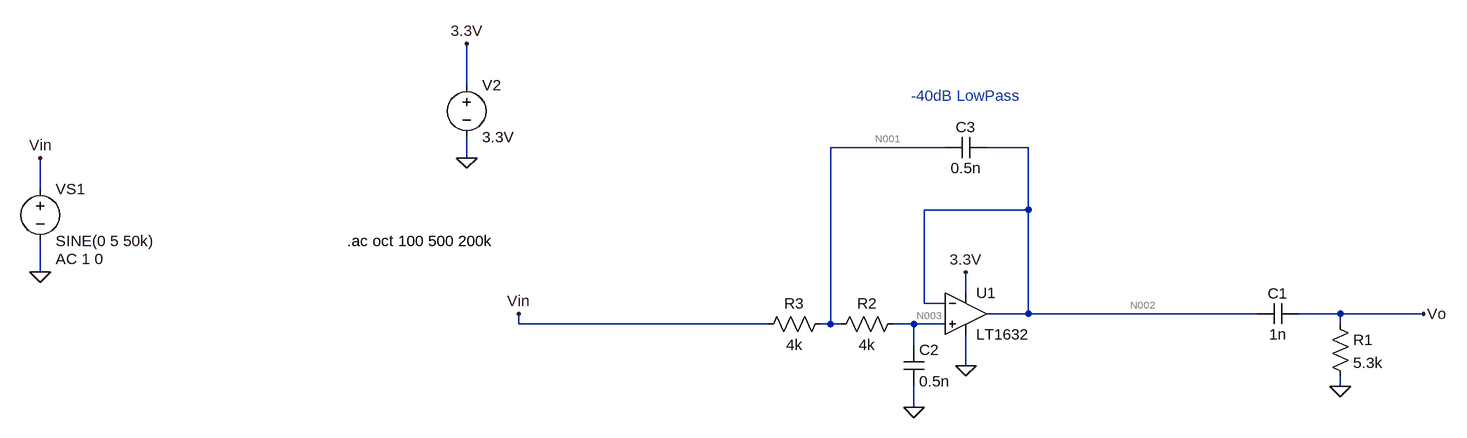
[diagram p0: schematic BandPass.asc]
BandPass.asc, the LTspice schematic file:
Version 4
SHEET 1 1588 680
WIRE 64 32 64 -32
WIRE 800 128 624 128
WIRE 928 128 864 128
WIRE 64 144 64 112
WIRE -592 192 -592 144
WIRE 928 224 928 128
WIRE 928 224 768 224
WIRE -592 320 -592 272
WIRE 832 352 832 320
WIRE 768 368 768 224
WIRE 800 368 768 368
WIRE 928 384 928 224
WIRE 928 384 864 384
WIRE 1280 384 928 384
WIRE 1408 384 1344 384
WIRE 1536 384 1408 384
WIRE 144 400 144 384
WIRE 528 400 144 400
WIRE 624 400 624 128
WIRE 624 400 608 400
WIRE 640 400 624 400
WIRE 752 400 720 400
WIRE 800 400 752 400
WIRE 1408 400 1408 384
WIRE 752 432 752 400
WIRE 832 464 832 416
WIRE 1408 496 1408 480
WIRE 752 528 752 496
FLAG 144 384 Vin
FLAG 1408 496 0
FLAG 1536 384 Vo
FLAG 64 144 0
FLAG 64 -32 3.3V
FLAG -592 320 0
FLAG -592 144 Vin
FLAG 832 320 3.3V
FLAG 752 528 0
FLAG 832 464 0
SYMBOL res 1392 384 R0
SYMATTR InstName R1
SYMATTR Value 5.3k
SYMBOL cap 1280 400 R270
WINDOW 0 32 32 VTop 2
WINDOW 3 0 32 VBottom 2
SYMATTR InstName C1
SYMATTR Value 1n
SYMBOL voltage 64 16 R0
WINDOW 123 0 0 Left 2
WINDOW 39 0 0 Left 2
SYMATTR InstName V2
SYMATTR Value 3.3V
SYMBOL voltage -592 176 R0
WINDOW 123 24 124 Left 2
WINDOW 39 0 0 Left 2
SYMATTR Value2 AC 1 0
SYMATTR InstName VS1
SYMATTR Value SINE(0 5 50k)
SYMBOL res 736 384 R90
WINDOW 0 0 56 VBottom 2
WINDOW 3 32 56 VTop 2
SYMATTR InstName R2
SYMATTR Value 4k
SYMBOL cap 736 432 R0
SYMATTR InstName C2
SYMATTR Value 0.5n
SYMBOL cap 864 112 R90
WINDOW 0 0 32 VBottom 2
WINDOW 3 32 32 VTop 2
SYMATTR InstName C3
SYMATTR Value 0.5n
SYMBOL res 624 384 R90
WINDOW 0 0 56 VBottom 2
WINDOW 3 32 56 VTop 2
SYMATTR InstName R3
SYMATTR Value 4k
SYMBOL Opamps\\LT1632 832 320 R0
SYMATTR InstName U1
TEXT -120 272 Left 2 !.ac oct 100 500 200k
TEXT 832 48 Center 2 ;-40dB LowPass

The netlist it stands for:
* BandPass.asc
R1 Vo 0 5.3k
C1 N002 Vo 1n
V2 3.3V 0 3.3V
VS1 Vin 0 SINE(0 5 50k) AC 1 0
R2 N003 N001 4k
C2 N003 0 0.5n
C3 N002 N001 0.5n
R3 N001 Vin 4k
XU1 N003 N002 3.3V 0 N002 LT1632  ; pins In+ In- V+ V- OUT
.ac oct 100 500 200k
* -40dB LowPass
.lib LTC.lib
.backanno
.end

* Results of the author's LTspice run, read from the files saved beside the schematic
* Operating Point, zero values left out:
*   V(n002) = 9.217 mV
*   V(3.3v) = 3.3 V
*   V(n003) = 9.209 mV
*   V(n001) = 4.605 mV
*   I(R3) = 1.151 µA
*   I(R2) = 1.151 µA
*   I(Vs1) = 1.151 µA
*   I(V2) = -3.523 mA
*   Ix(u1:1) = -1.151 µA
*   Ix(u1:2) = -1.151 µA
*   Ix(u1:3) = 3.523 mA
*   Ix(u1:4) = -3.521 mA
*   Ix(u1:5) = 1.151 µA
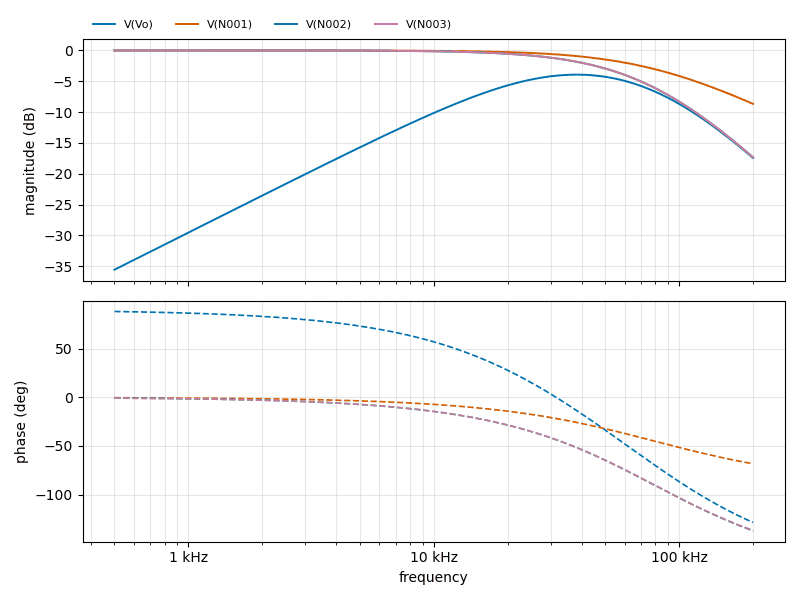
[diagram p1: AC Analysis of BandPass.asc, plotted from the saved traces]
* AC Analysis, 1 run:
*   V(Vo): -35.57 dB at 500 Hz, -17.46 dB at 200 kHz, peak -3.93 dB at 38.32 kHz, 3 dB below the peak at 15.92 kHz and 82.34 kHz
*   V(N001): -0.00 dB at 500 Hz, -8.67 dB at 200 kHz, peak -0.00 dB at 500 Hz, 3 dB below the peak at 78.91 kHz
*   V(N002): -0.00 dB at 500 Hz, -17.36 dB at 200 kHz, peak -0.00 dB at 500 Hz, 3 dB below the peak at 50.68 kHz
*   V(N003): -0.00 dB at 500 Hz, -17.37 dB at 200 kHz, peak -0.00 dB at 500 Hz, 3 dB below the peak at 50.73 kHz